# Altium schematic sheet NRF24L01.SchDoc
size A4
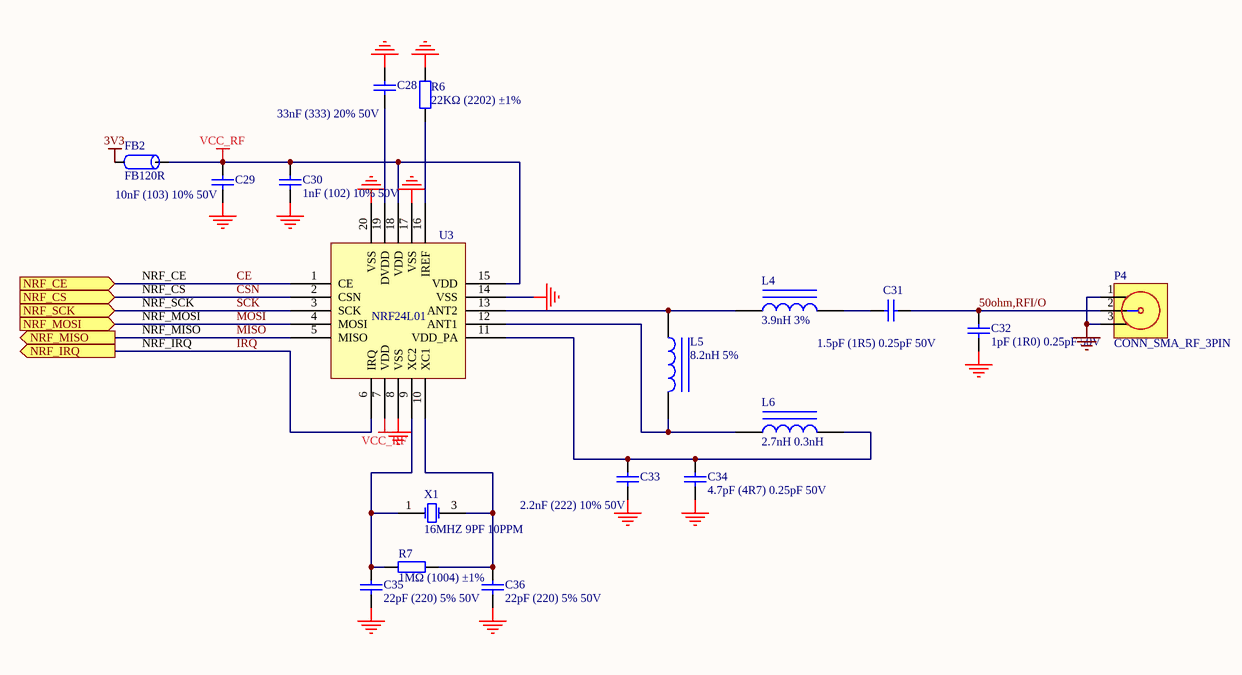
[diagram p0: NRF24L01.SchDoc]

## Parts
C28  33nF (333) 20% 50V  [0402_C]
C29  10nF (103) 10% 50V  [0402_C]
C30  1nF (102) 10% 50V  [0402_C]
C31  1.5pF (1R5) 0.25pF 50V  [0402_C]
C32  1pF (1R0) 0.25pF 50V  [0402_C]
C33  2.2nF (222) 10% 50V  [0402_C]
C34  4.7pF (4R7) 0.25pF 50V  [0402_C]
C35  22pF (220) 5% 50V  [0402_C]
C36  22pF (220) 5% 50V  [0402_C]
FB2  FB120R  [L0603]
L4  3.9nH 3%  [0402_L]
L5  8.2nH 5%  [0402_L]
L6  2.7nH 0.3nH  [0402_L]
P4  CONN_SMA_RF_3PIN  [PH_RF_2.5X2.5]
R6  22KΩ (2202) ±1%  [0402_R]
R7  1MΩ (1004) ±1%  [0402_R]
U3  NRF24L01  [QFN-20_4X4X05P]
X1  16MHZ 9PF 10PPM  [SMD-3225_4P]

## Ports
NRF_CE (in), NRF_CS (in), NRF_IRQ (out), NRF_MISO (out), NRF_MOSI (in), NRF_SCK (in)

## Nets
3V3: FB2.2
GND: C28.2 C29.1 C30.1 C32.1 C33.1 C34.1 C35.1 C36.1 P4.1 P4.3 R6.2 U3.8(VSS) U3.14(VSS) U3.17(VSS) U3.20(VSS)
VCC_RF: C29.2 C30.2 FB2.1 U3.7(VDD) U3.15(VDD) U3.18(VDD)
50ohm,RFI/O: C31.2 C32.2 P4.2
CE: U3.1(CE) ; port NRF_CE  [also labelled NRF_CE]
CSN: U3.2(CSN) ; port NRF_CS  [also labelled NRF_CS]
IRQ: U3.6(IRQ) ; port NRF_IRQ  [also labelled NRF_IRQ]
MISO: U3.5(MISO) ; port NRF_MISO  [also labelled NRF_MISO]
MOSI: U3.4(MOSI) ; port NRF_MOSI  [also labelled NRF_MOSI]
NRF_SCK: U3.3(SCK) ; port NRF_SCK  [also labelled SCK]
NetC28_1: C28.1 U3.19(DVDD)
NetC31_1: C31.1 L4.2
NetC33_2: C33.2 C34.2 L6.2 U3.11(VDD_PA)
NetC35_2: C35.2 R7.1 U3.9(XC2) X1.1(OSC1)
NetC36_2: C36.2 R7.2 U3.10(XC1) X1.3(OSC2)
NetL4_1: L4.1 L5.1 U3.13(ANT2)
NetL5_2: L5.2 L6.1 U3.12(ANT1)
NetR6_1: R6.1 U3.16(IREF)

## Notes on the sheet
- (near P4) SMA

## Library data of the parts
C28 = 0402 33nF (333) 20% 50V: 贴片电容; ComponentLink1Description: 供应商链接; ComponentLink1URL: http://www.szlcsc.com/product/details_1937.html; Package: 0402; Supplier: LC; SuppliersPartNumber: C1585
C29 = 0402 10nF (103) 10% 50V: 贴片电容; ComponentLink1Description: 供应商链接; ComponentLink1URL: http://www.szlcsc.com/product/details_15869.html; Package: 0402; Supplier: LC; SuppliersPartNumber: C15195
C30 = 0402 1nF (102) 10% 50V: 贴片电容; ComponentLink1Description: 供应商链接; ComponentLink1URL: http://www.szlcsc.com/product/details_1875.html; Package: 0402; Supplier: LC; SuppliersPartNumber: C1523
C31 = 0402 1.5pF (1R5) 0.25pF 50V: 贴片电容; ComponentLink1Description: 供应商链接; ComponentLink1URL: http://www.szlcsc.com/product/details_1904.html; Package: 0402; Supplier: LC; SuppliersPartNumber: C1552
C32 = 0402 1pF (1R0) 0.25pF 50V: 贴片电容; ComponentLink1Description: 供应商链接; ComponentLink1URL: http://www.szlcsc.com/product/details_1902.html; Package: 0402; Supplier: LC; SuppliersPartNumber: C1550
C33 = 0402 2.2nF (222) 10% 50V: 贴片电容; ComponentLink1Description: 供应商链接; ComponentLink1URL: http://www.szlcsc.com/product/details_1883.html; Package: 0402; Supplier: LC; SuppliersPartNumber: C1531
C34 = 0402 4.7pF (4R7) 0.25pF 50V: 贴片电容; ComponentLink1Description: 供应商链接; ComponentLink1URL: http://www.szlcsc.com/product/details_1921.html; Package: 0402; Supplier: LC; SuppliersPartNumber: C1569
C35 C36 = 0402 22pF (220) 5% 50V: 贴片电容; ComponentLink1Description: 供应商链接; ComponentLink1URL: http://www.szlcsc.com/product/details_1907.html; Package: 0402; Supplier: LC; SuppliersPartNumber: C1555
FB2 = FB_0603_120R: 贴片磁珠; Manufacturer: TDK; Part Number: RP02.99.000093; LatestRevisionDate: 09-Feb-2017; LatestRevisionNote: SCHlib build; Publisher: ChenYinaho; Manufacturer Part Number: *; Value: FB120R
L4 = 0402 3.9nH 3%: 贴片电感; ComponentLink1Description: 供应商链接; ComponentLink1URL: http://www.szlcsc.com/product/details_14690.html; Package: 0402; Supplier: LC; SuppliersPartNumber: C14033
L5 = 0402 8.2nH 5%: 贴片电感; ComponentLink1Description: 供应商链接; ComponentLink1URL: http://www.szlcsc.com/product/details_16890.html; Package: 0402; Supplier: LC; SuppliersPartNumber: C16208
L6 = 0402 2.7nH 0.3nH: 贴片电感; ComponentLink1Description: 供应商链接; ComponentLink1URL: http://www.szlcsc.com/product/details_27872.html; Package: 0402; Supplier: LC; SuppliersPartNumber: C27123
P4 = CONN_SMA_RF_3PIN: 贴片天线座; Part Number: RP02.07.000078; LatestRevisionDate: 09-Feb-2017; LatestRevisionNote: SCHlib build; Publisher: ChenYinaho; Manufacturer: *; Manufacturer Part Number: *; Value: CONN_SMA_RF_3PIN
R6 = 0402 22KΩ (2202) 1%: 贴片电阻; ComponentLink1Description: 供应商链接; ComponentLink1URL: http://www.szlcsc.com/product/details_26511.html; Package: 0402; Supplier: LC; SuppliersPartNumber: C25768
R7 = 0402 1MΩ (1004) 1%: 贴片电阻; ComponentLink1Description: 供应商链接; ComponentLink1URL: http://www.szlcsc.com/product/details_26826.html; Package: 0402; Supplier: LC; SuppliersPartNumber: C26083
X1 = SMD-3225_4P  16MHZ 9PF 10PPM: 贴片晶振; ComponentLink1Description: 供应商链接; ComponentLink1URL: http://www.szlcsc.com/product/details_14393.html; Package: SMD-3225_4P; Supplier: LC; SuppliersPartNumber: C13738